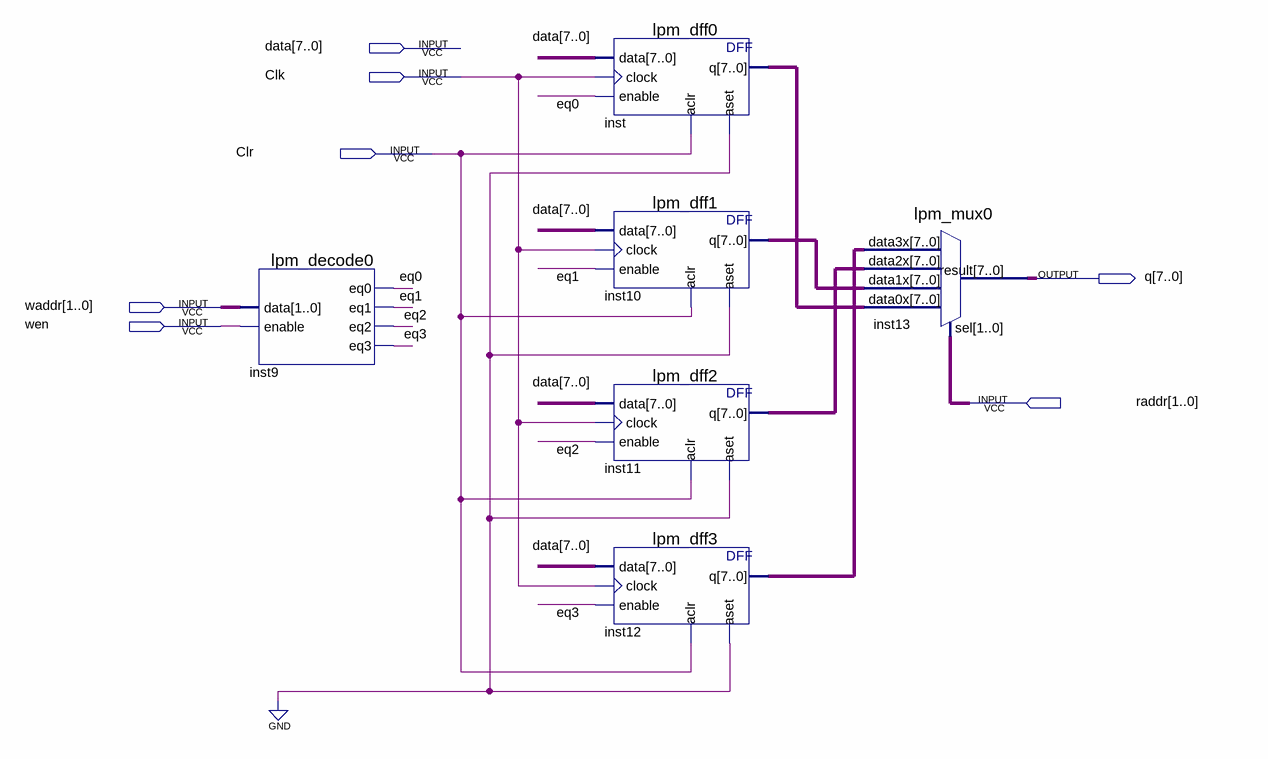
[diagram p0: schematic sheet]
// Quartus schematic GPRs.bdf as structural Verilog: 6 symbols, 7 pins
module GPRs (
  input  [7:0] data,
  input  Clk,
  input  Clr,
  input  [1:0] waddr,
  input  wen,
  input  [1:0] raddr,
  output [7:0] q
);

  wire eq0, eq1, eq2, eq3;
  wire [7:0] inst10_q, inst11_q, inst12_q, inst_q;

  lpm_decode0 inst9 (.data(waddr), .enable(wen), .eq0(eq0), .eq1(eq1), .eq2(eq2), .eq3(eq3));
  lpm_dff0 inst (.data(data), .clock(Clk), .enable(eq0), .aclr(Clr), .aset(1'b0), .q(inst_q));
  lpm_dff1 inst10 (.data(data), .clock(Clk), .enable(eq1), .aclr(Clr), .aset(1'b0), .q(inst10_q));
  lpm_dff2 inst11 (.data(data), .clock(Clk), .enable(eq2), .aclr(Clr), .aset(1'b0), .q(inst11_q));
  lpm_dff3 inst12 (.data(data), .clock(Clk), .enable(eq3), .aclr(Clr), .aset(1'b0), .q(inst12_q));
  lpm_mux0 inst13 (.data3x(inst12_q), .data2x(inst11_q), .data1x(inst10_q), .data0x(inst_q), .sel(raddr), .result(q));
endmodule
